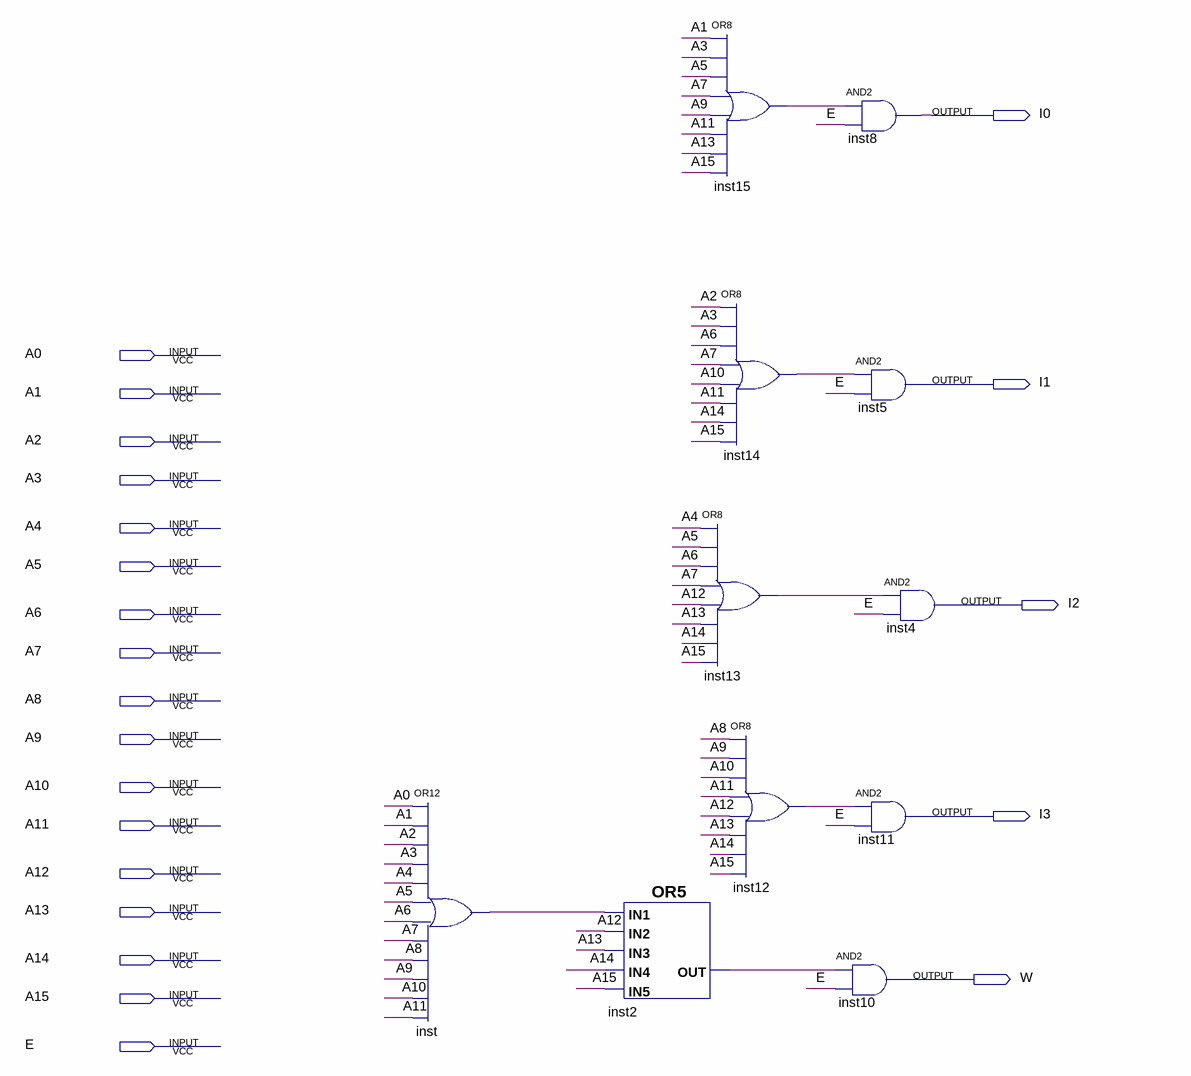
[diagram p0: schematic sheet]
// Quartus schematic CD16TO4.bdf as structural Verilog: 11 symbols, 22 pins
module CD16TO4 (
  input  A0,
  input  A1,
  input  A2,
  input  A3,
  input  A4,
  input  A5,
  input  A6,
  input  A7,
  input  A8,
  input  A9,
  input  A10,
  input  A11,
  input  A12,
  input  A13,
  input  A14,
  input  A15,
  input  E,
  output I0,
  output I1,
  output I2,
  output I3,
  output W
);

  wire inst2_out, inst12_out, inst13_out, inst14_out, inst15_out, inst_out;

  or inst (inst_out, A0, A1, A2, A3, A4, A5, A6, A7, A8, A9, A10, A11);
  or inst2 (inst2_out, inst_out, A12, A13, A14, A15);
  or inst13 (inst13_out, A4, A5, A6, A7, A12, A13, A14, A15);
  or inst15 (inst15_out, A1, A3, A5, A7, A9, A11, A13, A15);
  or inst14 (inst14_out, A2, A3, A6, A7, A10, A11, A14, A15);
  or inst12 (inst12_out, A8, A9, A10, A11, A12, A13, A14, A15);
  and inst8 (I0, inst15_out, E);
  and inst5 (I1, inst14_out, E);
  and inst11 (I3, inst12_out, E);
  and inst10 (W, inst2_out, E);
  and inst4 (I2, inst13_out, E);
endmodule
